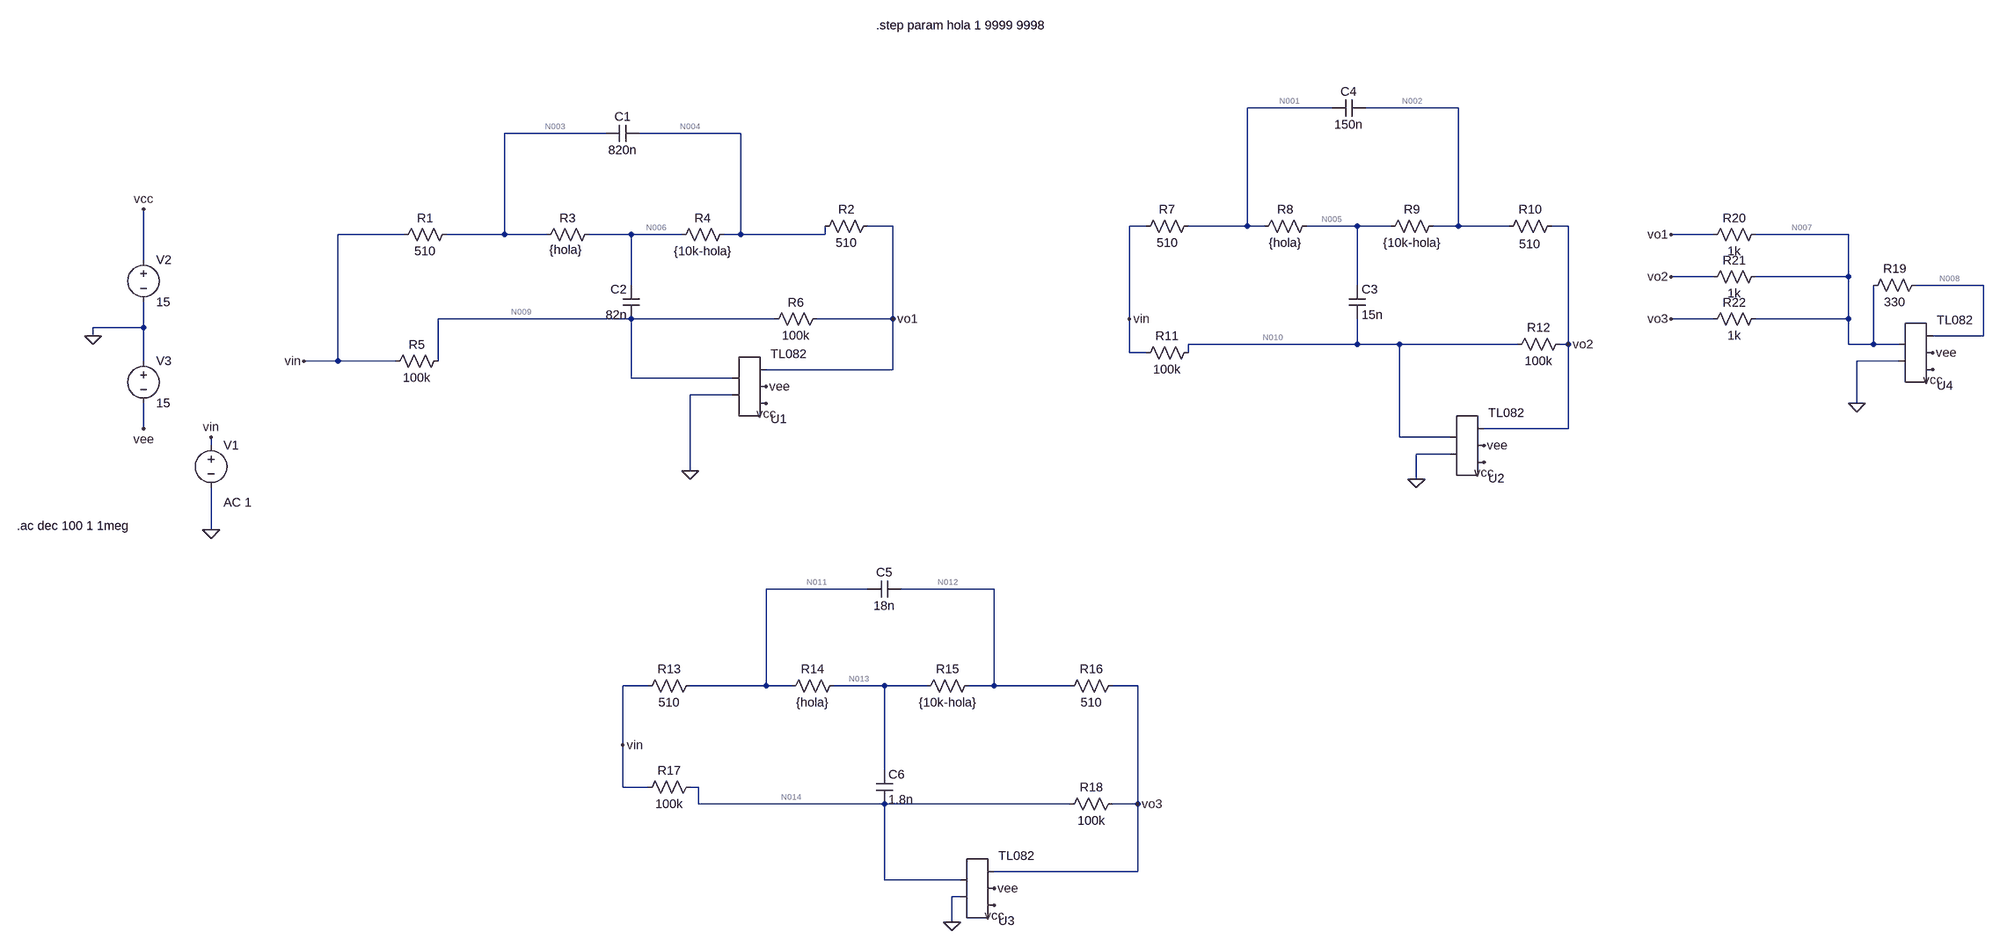
[diagram p0: schematic Spice.asc]
* Spice.asc
R1 N003 vin 510
R2 vo1 N004 510
R3 N006 N003 {hola}
R4 N004 N006 {10k-hola}
R5 N009 vin 100k
R6 vo1 N009 100k
C1 N004 N003 820n
C2 N009 N006 82n
V1 vin 0 AC 1
V2 vcc 0 15
V3 0 vee 15
* U1: TL082 (symbol AutoGenerated\TL082 not available, pins judged from their places): pin1=0 pin2=N009 pin3=vcc pin4=vee pin5=vo1
R7 N001 vin 510
R8 N005 N001 {hola}
R9 N002 N005 {10k-hola}
R10 vo2 N002 510
R11 N010 vin 100k
R12 vo2 N010 100k
C3 N005 N010 15n
C4 N002 N001 150n
* U2: TL082 (symbol AutoGenerated\TL082 not available, pins judged from their places): pin1=0 pin2=N010 pin3=vcc pin4=vee pin5=vo2
R13 N011 vin 510
R14 N013 N011 {hola}
R15 N012 N013 {10k-hola}
R16 vo3 N012 510
R17 N014 vin 100k
R18 vo3 N014 100k
C5 N012 N011 18n
C6 N013 N014 1.8n
* U3: TL082 (symbol AutoGenerated\TL082 not available, pins judged from their places): pin1=0 pin2=N014 pin3=vcc pin4=vee pin5=vo3
* U4: TL082 (symbol AutoGenerated\TL082 not available, pins judged from their places): pin1=0 pin2=N007 pin3=vcc pin4=vee pin5=N008
R19 N008 N007 330
R20 N007 vo1 1k
R21 N007 vo2 1k
R22 N007 vo3 1k
.ac dec 100 1 1meg
.step param hola 1 9999 9998
.backanno
.end

* Results of the author's LTspice run, read from the files saved beside the schematic
* Operating Point (first step), zero values left out:
*   hola = 1 
*   V(n003) = 1.224 µV
*   V(vo1) = 26.45 µV
*   V(n004) = 25.22 µV
*   V(n006) = 1.226 µV
*   V(n009) = 10.97 µV
*   V(vcc) = 15 V
*   V(vee) = -15 V
*   V(n001) = 1.224 µV
*   V(n005) = 1.226 µV
*   V(n002) = 25.22 µV
*   V(vo2) = 26.45 µV
*   V(n010) = 10.97 µV
*   V(n011) = 1.224 µV
*   V(n013) = 1.226 µV
*   V(n012) = 25.22 µV
*   V(vo3) = 26.45 µV
*   V(n014) = 10.97 µV
*   V(n008) = -4.335 µV
*   V(n007) = 10.97 µV
*   I(R22) = -15.48 nA
*   I(R21) = -15.48 nA
*   I(R20) = -15.48 nA
*   I(R19) = -46.38 nA
*   I(R18) = 154.8 pA
*   I(R17) = 109.7 pA
*   I(R16) = 2.4 nA
*   I(R15) = 2.4 nA
*   I(R14) = 2.4 nA
*   I(R13) = 2.4 nA
*   I(R12) = 154.8 pA
*   I(R11) = 109.7 pA
*   I(R10) = 2.4 nA
*   I(R9) = 2.4 nA
*   I(R8) = 2.4 nA
*   I(R7) = 2.4 nA
*   I(R6) = 154.8 pA
*   I(R5) = 109.7 pA
*   I(R4) = 2.4 nA
*   I(R3) = 2.4 nA
*   I(R2) = 2.4 nA
*   I(R1) = 2.4 nA
*   I(V3) = -56.78 mA
*   I(V2) = -56.78 mA
*   I(V1) = 7.529 nA
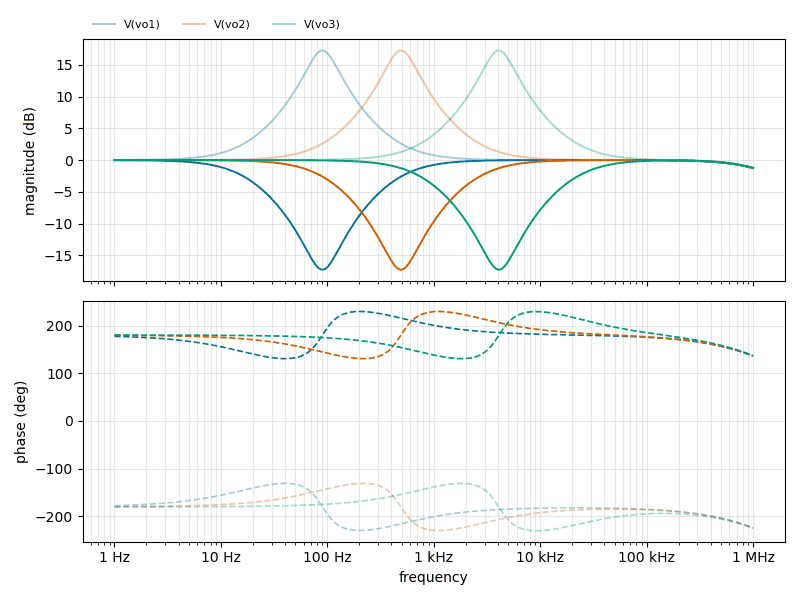
[diagram p1: AC Analysis of Spice.asc, plotted from the saved traces]
* AC Analysis, 2 runs:
*   V(vo1) [hola=1]: 0.01 dB at 1 Hz, -1.27 dB at 1 MHz, peak 17.27 dB at 89.13 Hz, 3 dB below the peak at 64.45 Hz and 125.6 Hz
*   V(vo1) [hola=9999]: -0.01 dB at 1 Hz, -1.27 dB at 1 MHz, peak -0.00 dB at 26.92 kHz, 3 dB below the peak at 448.2 Hz
*   V(vo2) [hola=1]: 0.00 dB at 1 Hz, -1.27 dB at 1 MHz, peak 17.28 dB at 489.8 Hz, 3 dB below the peak at 352.3 Hz and 686.4 Hz
*   V(vo2) [hola=9999]: -0.00 dB at 1 Hz, -1.26 dB at 1 MHz, peak -0.00 dB at 1 Hz, 3 dB below the peak at 98.75 Hz
*   V(vo3) [hola=1]: -0.00 dB at 1 Hz, -1.29 dB at 1 MHz, peak 17.28 dB at 4.074 kHz, 3 dB below the peak at 2.931 kHz and 5.7 kHz
*   V(vo3) [hola=9999]: -0.00 dB at 1 Hz, -1.22 dB at 1 MHz, peak -0.00 dB at 1 Hz, 3 dB below the peak at 822.7 Hz